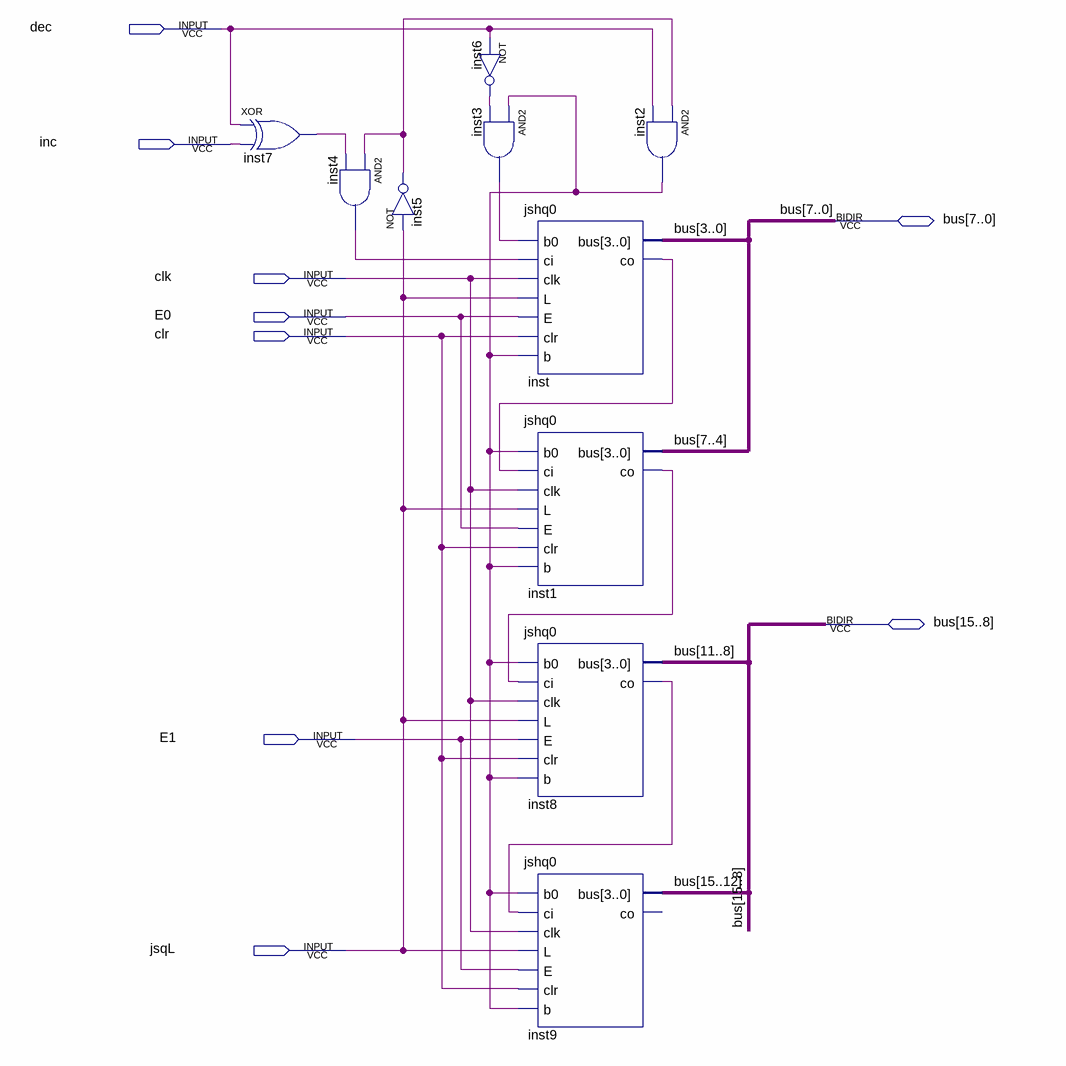
[diagram p0: schematic sheet]
// Quartus schematic jshqz.bdf as structural Verilog: 10 symbols, 9 pins
module jshqz (
  input  dec,
  input  inc,
  input  clk,
  input  E0,
  input  clr,
  input  E1,
  input  jsqL,
  inout  [15:0] bus
);

  wire inst1_co, inst2_out, inst3_out, inst4_out, inst5_out, inst6_out, inst7_out, inst8_co, inst_co;

  xor inst7 (inst7_out, dec, inc);
  and inst4 (inst4_out, inst5_out, inst7_out);
  not inst5 (inst5_out, jsqL);
  not inst6 (inst6_out, dec);
  and inst3 (inst3_out, inst2_out, inst6_out);
  jshq0 inst (
    .b0(inst3_out), .ci(inst4_out), .clk(clk), .L(jsqL), .E(E0), .clr(clr), .b(inst2_out), .co(inst_co),
    .bus(bus[3:0]));
  jshq0 inst1 (
    .b0(inst2_out), .ci(inst_co), .clk(clk), .L(jsqL), .E(E0), .clr(clr), .b(inst2_out), .co(inst1_co),
    .bus(bus[7:4]));
  jshq0 inst8 (
    .b0(inst2_out), .ci(inst1_co), .clk(clk), .L(jsqL), .E(E1), .clr(clr), .b(inst2_out), .co(inst8_co),
    .bus(bus[11:8]));
  jshq0 inst9 (
    .b0(inst2_out), .ci(inst8_co), .clk(clk), .L(jsqL), .E(E1), .clr(clr), .b(inst2_out), .bus(bus[15:12]));  // open: co
  and inst2 (inst2_out, inst5_out, dec);
endmodule
